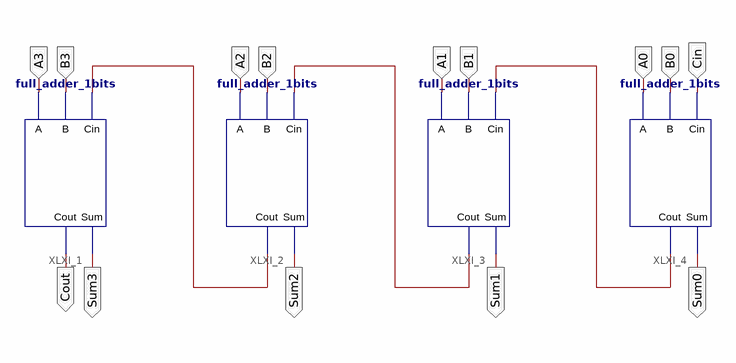
[diagram p0: schematic sheet 1]
// Xilinx ISE schematic ser_adder.sch (spartan6) as structural Verilog: 4 symbols, 14 ports
module ser_adder (
  input  A0,
  input  A1,
  input  A2,
  input  A3,
  input  B0,
  input  B1,
  input  B2,
  input  B3,
  input  Cin,
  output Sum0,
  output Sum1,
  output Sum2,
  output Sum3,
  output Cout
);

  wire XLXN_1, XLXN_2, XLXN_3;

  full_adder_1bits XLXI_1 (.A(A3), .B(B3), .Cin(XLXN_3), .Cout(Cout), .Sum(Sum3));
  full_adder_1bits XLXI_2 (.A(A2), .B(B2), .Cin(XLXN_2), .Cout(XLXN_3), .Sum(Sum2));
  full_adder_1bits XLXI_3 (.A(A1), .B(B1), .Cin(XLXN_1), .Cout(XLXN_2), .Sum(Sum1));
  full_adder_1bits XLXI_4 (.A(A0), .B(B0), .Cin(Cin), .Cout(XLXN_1), .Sum(Sum0));
endmodule
